# EAGLE schematic mainboard (EAGLE 7.7.0)
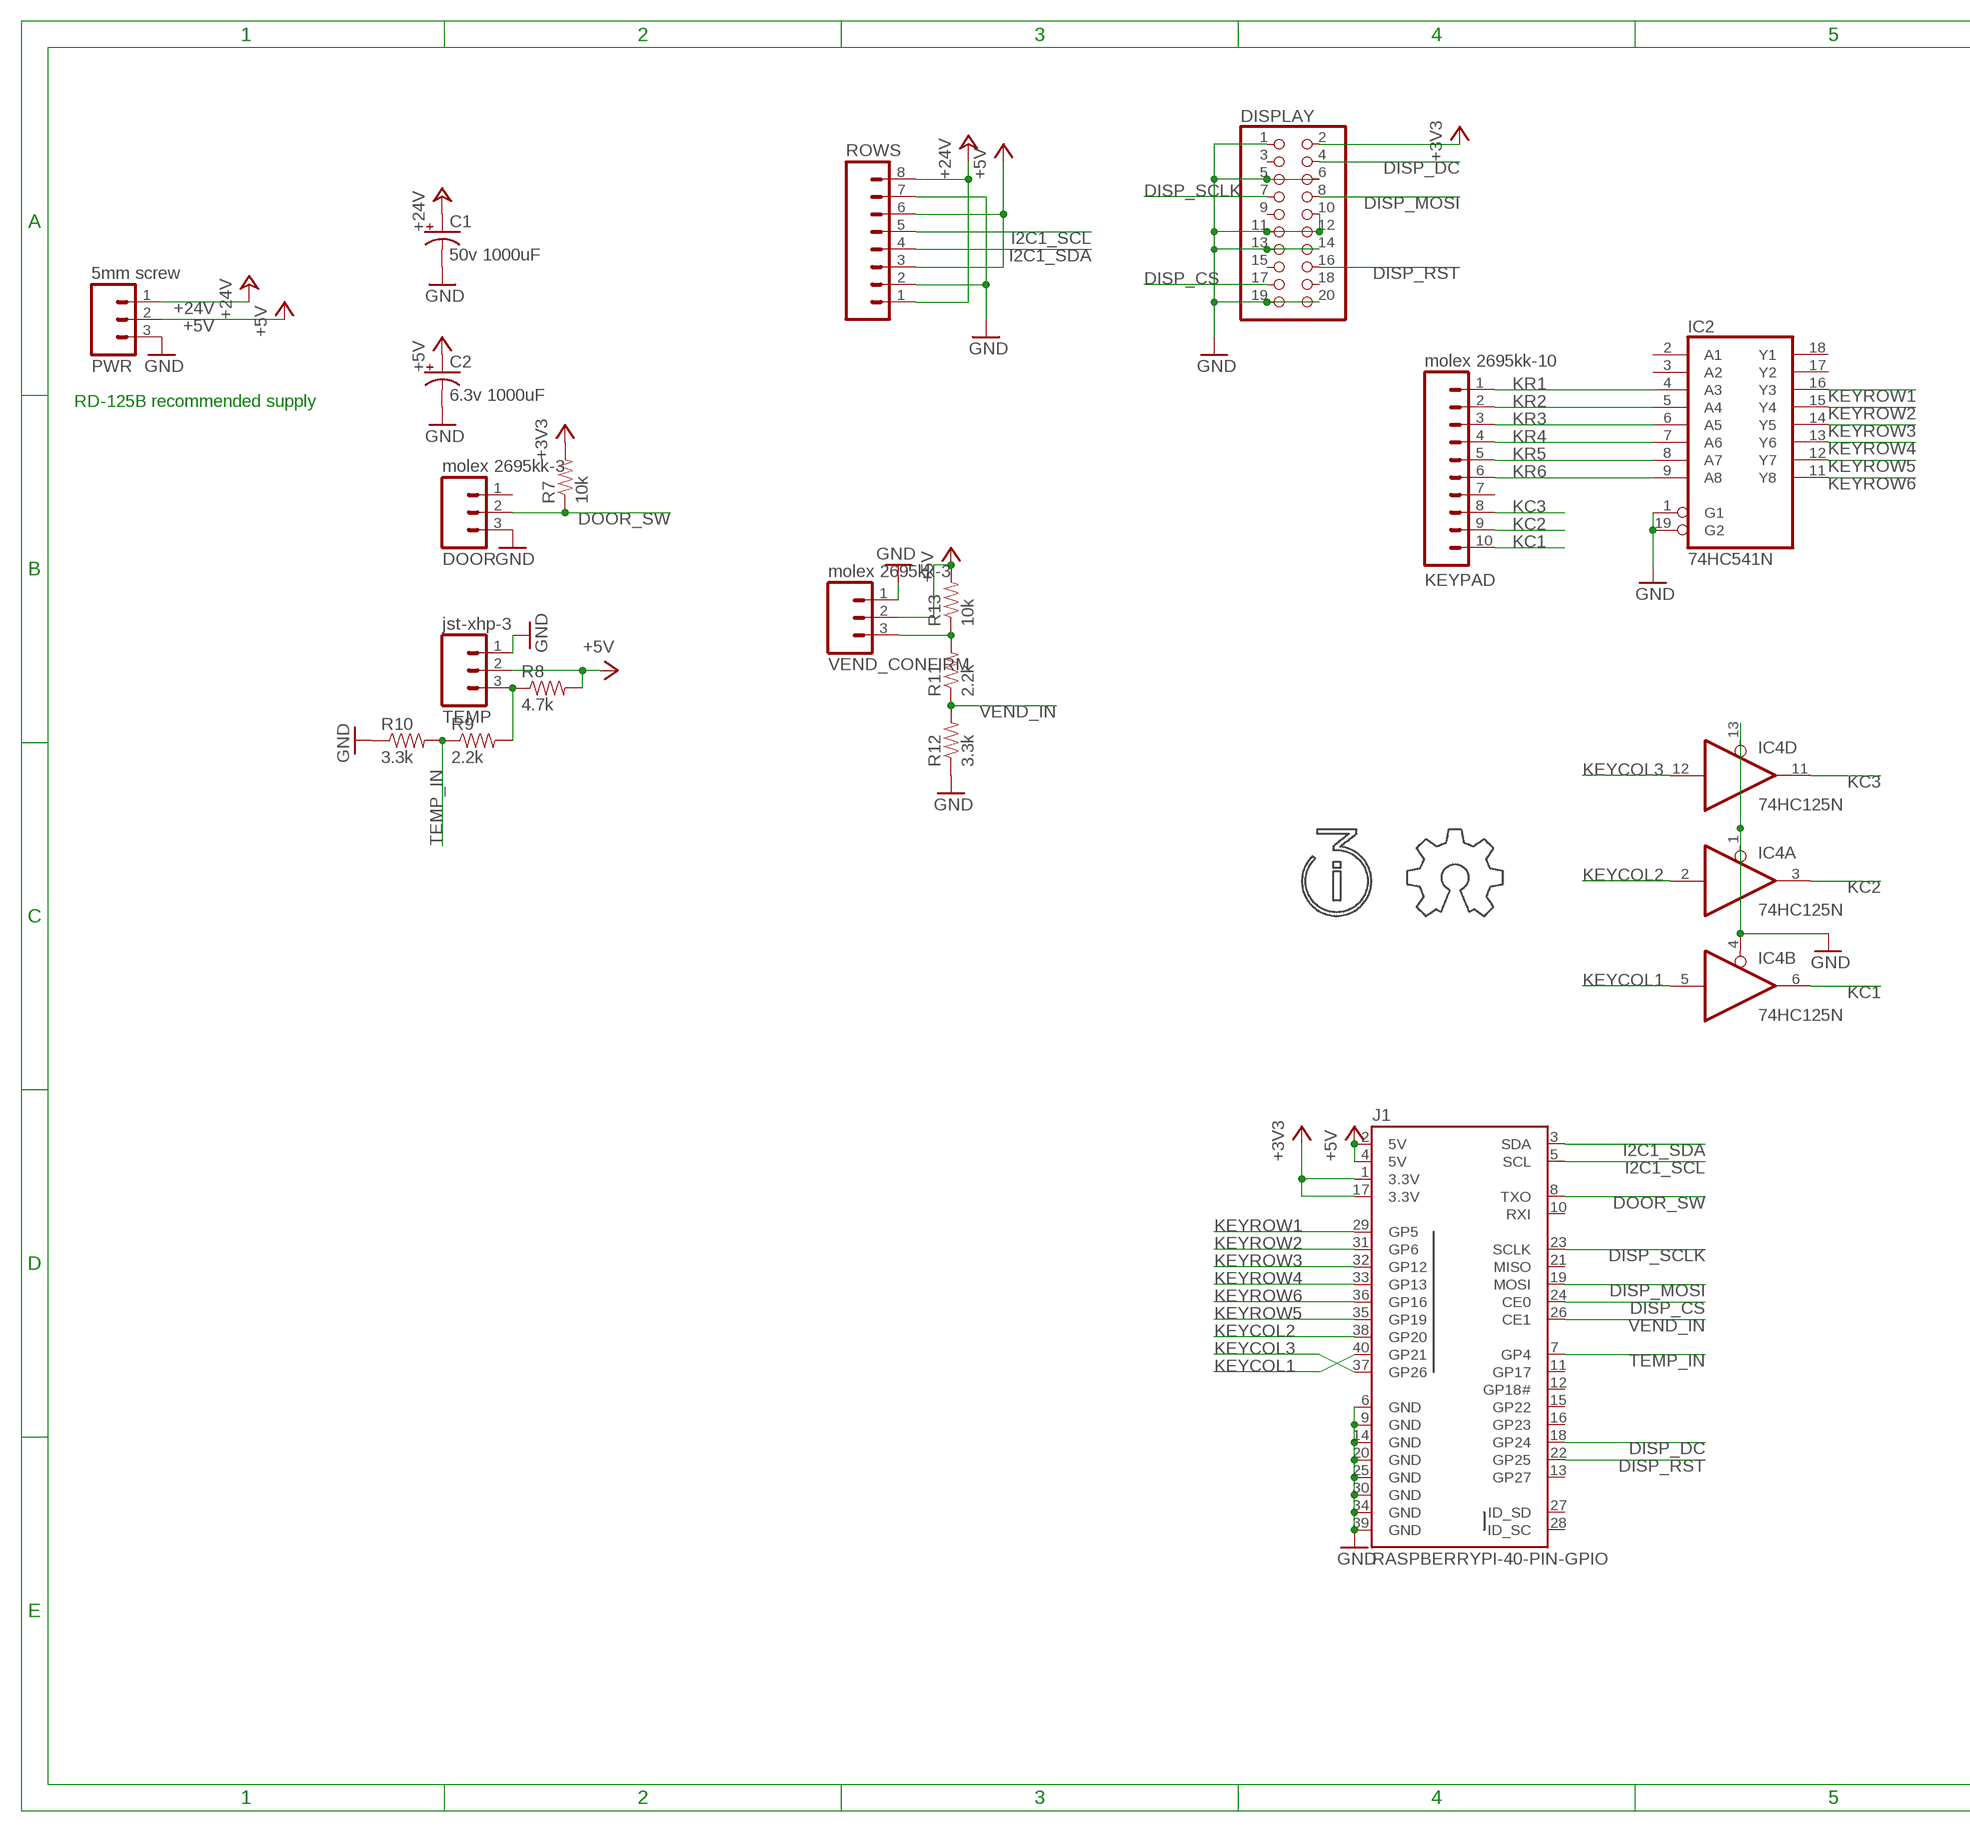
[diagram p0: schematic, sheet 1, part 1 of 2]
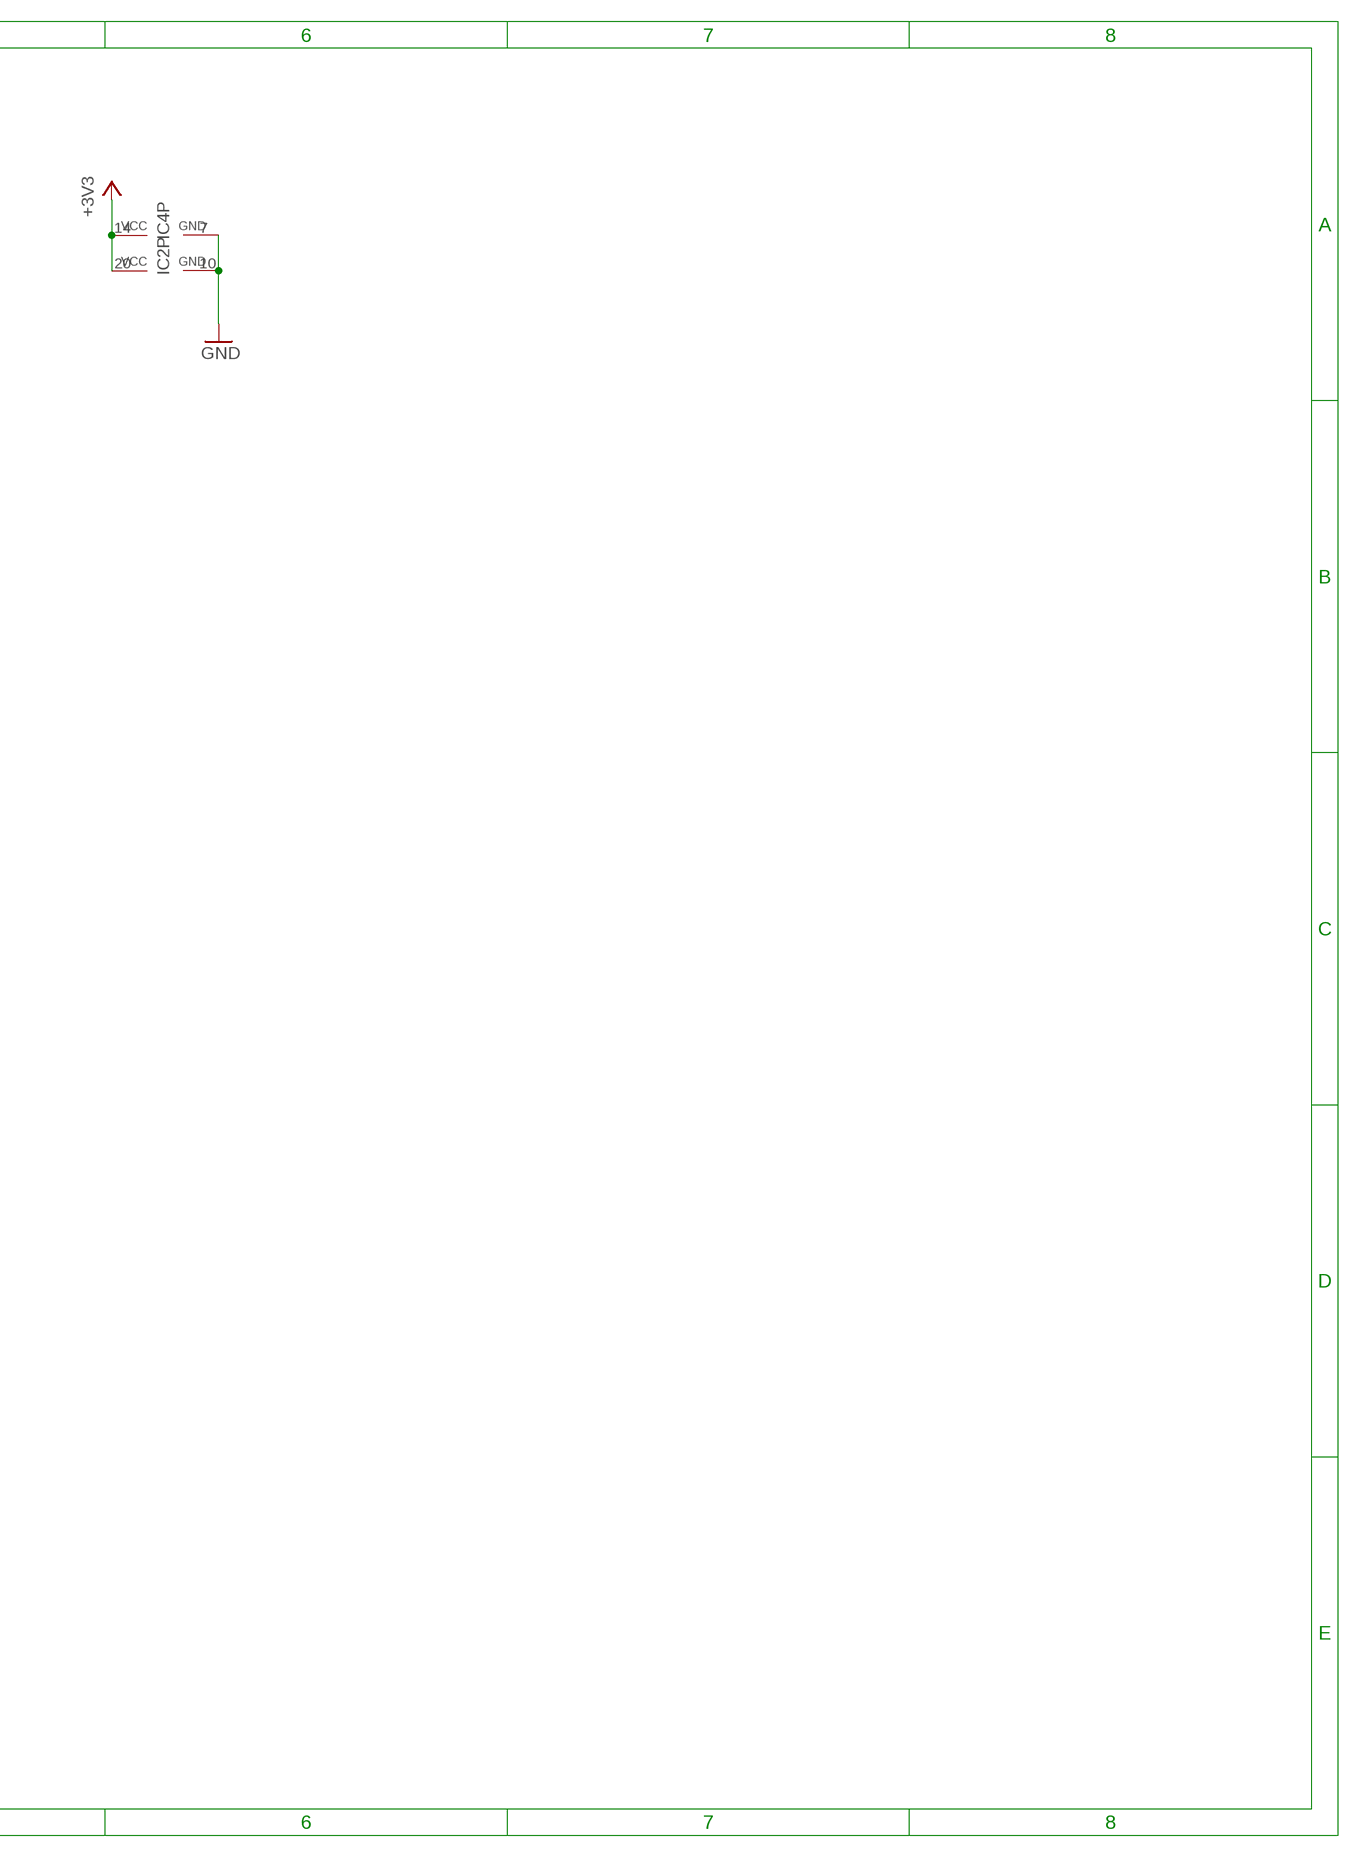
[diagram p1: schematic, sheet 1, part 2 of 2]

## Parts
C1  50v 1000uF  CAP_POLPTH4  [CPOL-RADIAL-1000UF-25V]
C2  6.3v 1000uF  CAP_POLPTH4  [CPOL-RADIAL-1000UF-25V]
DISPLAY  PINHD-2X10  [2X10]
DOOR  molex 2695kk-3  M03POLAR  [MOLEX-1X3]
IC2  74HC541N  [DIL20]
IC4  74HC125N  [DIL14]
J1  RASPBERRYPI-40-PIN-GPIO  [2X20-SHROUDED]
KEYPAD  molex 2695kk-10  M10LOCK  [1X10_LOCK]
PWR  5mm screw  M03-SCREW-5MM  [SCREWTERMINAL-5MM-3]
R7  10k  RESISTOR1206  [1206]
R8  4.7k  RESISTOR1206  [1206]
R9  2.2k  RESISTOR1206  [1206]
R10  3.3k  RESISTOR1206  [1206]
R11  2.2k  RESISTOR1206  [1206]
R12  3.3k  RESISTOR1206  [1206]
R13  10k  RESISTOR1206  [1206]
ROWS  M08FEMALE_LOCK  [1X08_FEMALE_LOCK]
TEMP  jst-xhp-3  M03PTH  [1X03]
U$1  I3LOGO  [I3LOGO]
U$2  OSHWLOGO  [OSHWLOGO]
VEND_CONFIRM  molex 2695kk-3  M03POLAR  [MOLEX-1X3]

## Nets
+3V3: DISPLAY.2 IC2.20(VCC) IC4.14(P:VCC) J1.1(3.3V) J1.17(3.3V) R7.2
+5V: C2.+ J1.2(5V) J1.4(5V) PWR.2 R8.2 R13.2 ROWS.3 ROWS.6 TEMP.2 VEND_CONFIRM.2
+24V: C1.+ PWR.1 ROWS.1 ROWS.8
DISP_CS: DISPLAY.17 J1.24(CE0)
DISP_DC: DISPLAY.4 J1.18(GP24)
DISP_MOSI: DISPLAY.8 J1.19(MOSI)
DISP_RST: DISPLAY.16 J1.22(GP25)
DISP_SCLK: DISPLAY.7 J1.23(SCLK)
DOOR_SW: DOOR.2 J1.8(TXO) R7.1
GND: C1.- C2.- DISPLAY.1 DISPLAY.5 DISPLAY.6 DISPLAY.10 DISPLAY.11 DISPLAY.12 DISPLAY.13 DISPLAY.14 DISPLAY.19 DISPLAY.20 DOOR.3 IC2.1(G1) IC2.10(GND) IC2.19(G2) IC4.1(A:OE) IC4.4(B:OE) IC4.7(P:GND) IC4.13(D:OE) J1.6(GND) J1.9(GND) J1.14(GND) J1.20(GND) J1.25(GND) J1.30(GND) J1.34(GND) J1.39(GND) PWR.3 R10.1 R12.1 ROWS.2 ROWS.7 TEMP.1 VEND_CONFIRM.1
I2C1_SCL: J1.5(SCL) ROWS.5
I2C1_SDA: J1.3(SDA) ROWS.4
KC1: IC4.6(B:O) KEYPAD.10
KC2: IC4.3(A:O) KEYPAD.9
KC3: IC4.11(D:O) KEYPAD.8
KEYCOL1: IC4.5(B:I) J1.40(GP21)
KEYCOL2: IC4.2(A:I) J1.38(GP20)
KEYCOL3: IC4.12(D:I) J1.37(GP26)
KEYROW1: IC2.16(Y3) J1.29(GP5)
KEYROW2: IC2.15(Y4) J1.31(GP6)
KEYROW3: IC2.14(Y5) J1.32(GP12)
KEYROW4: IC2.13(Y6) J1.33(GP13)
KEYROW5: IC2.12(Y7) J1.35(GP19)
KEYROW6: IC2.11(Y8) J1.36(GP16)
KR1: IC2.4(A3) KEYPAD.1
KR2: IC2.5(A4) KEYPAD.2
KR3: IC2.6(A5) KEYPAD.3
KR4: IC2.7(A6) KEYPAD.4
KR5: IC2.8(A7) KEYPAD.5
KR6: IC2.9(A8) KEYPAD.6
N$1: R8.1 R9.2 TEMP.3
N$5: R11.2 R13.1 VEND_CONFIRM.3
TEMP_IN: J1.7(GP4) R9.1 R10.2
VEND_IN: J1.26(CE1) R11.1 R12.2
Unconnected: DISPLAY.3 DISPLAY.9 DISPLAY.15 DISPLAY.18 DOOR.1 IC2.2(A1) IC2.3(A2) IC2.17(Y2) IC2.18(Y1) IC4.8(C:O) IC4.9(C:I) IC4.10(C:OE) J1.10(RXI) J1.11(GP17) J1.12(GP18#) J1.13(GP27) J1.15(GP22) J1.16(GP23) J1.21(MISO) J1.27(ID_SD) J1.28(ID_SC) KEYPAD.7

## Notes on the sheet
- RD-125B recommended supply

## Library data of the parts
C1 C2 = SparkFun-Capacitors:CAP_POL: Capacitor Polarized These are standard SMD and PTH capacitors. Normally 10uF, 47uF, and 100uF in electrolytic and tantalum varieties. Always verify the external diameter of the through hole cap, it varies with capacity, voltage, and manufacturer. The EIA devices should be standard.
DISPLAY = SparkFun-Connectors:PINHD-2X10: PIN HEADER
DOOR TEMP VEND_CONFIRM = SparkFun-Connectors:M03: Header 3 Standard 3-pin 0.1" header. Use with straight break away headers (SKU : PRT-00116), right angle break away headers (PRT-00553), swiss pins (PRT-00743), machine pins (PRT-00117), and female headers (PRT-00115). Molex polarized connector foot print use with SKU : PRT-08232 with associated crimp pins and housings.
IC2 = 74xx-eu:74*541: Octal BUFFER and LINE DRIVER, 3-state
IC4 = 74xx-eu:74*125: Quad bus BUFFER, 3-state
J1 = SparkFun-Boards:RASPBERRYPI-40-PIN-GPIO: Second Generation Raspberry Pi GPIO Header 2x20 pin connector, as found on B, B+, A+ models.
KEYPAD = SparkFun-Connectors:M10: Header 10 Standard 10-pin 0.1" header. Use with straight break away headers (SKU : PRT-00116), right angle break away headers (PRT-00553), swiss pins (PRT-00743), machine pins (PRT-00117), and female headers (PRT-00115).
PWR = SparkFun-Connectors:M03: Header 3 Standard 3-pin 0.1" header. Use with straight break away headers (SKU : PRT-00116), right angle break away headers (PRT-00553), swiss pins (PRT-00743), machine pins (PRT-00117), and female headers (PRT-00115). Molex polarized connector foot print use with SKU : PRT-08232 with associated crimp pins and housings.; STOREFRONT_ID: PRT-08433
R7-R13 = SparkFun-Passives:RESISTOR: Resistor Basic schematic elements and footprints for 0603, 1206, and PTH resistors.
ROWS = SparkFun-Connectors:M08: Header 8 Standard 8-pin 0.1" header. Use with straight break away headers (SKU : PRT-00116), right angle break away headers (PRT-00553), swiss pins (PRT-00743), machine pins (PRT-00117), and female headers (PRT-00115).
U$1 = vending:I3LOGO: The i3Detroit square logo ("i3") as lines in the Info/tNames layers
U$2 = vending:OSHWLOGO: The OSHW logo as lines on Info/tNames layers